# EAGLE design micro_board (EAGLE 7.7.0)
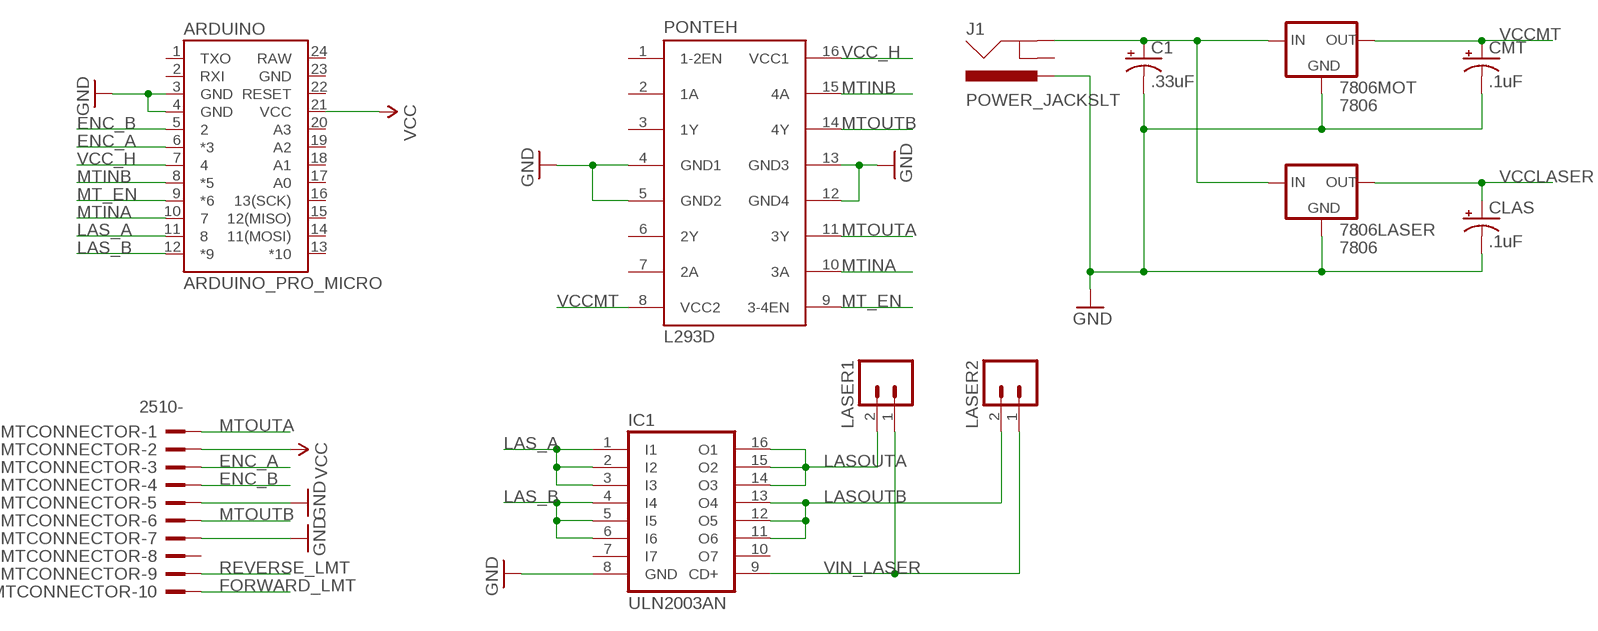
[diagram p0: schematic, sheet 1]

## Parts
7806LASER  7806  V_REG_78XXSINK  [TO220-IGO]
7806MOT  7806  V_REG_78XXSINK  [TO220-IGO]
ARDUINO  ARDUINO_PRO_MICRO  [ARDUINO_PRO_MICRO]
C1  .33uF  CAP_POLPTH1  [CPOL-RADIAL-100UF-25V]
CLAS  .1uF  CAP_POLPTH1  [CPOL-RADIAL-100UF-25V]
CMT  .1uF  CAP_POLPTH1  [CPOL-RADIAL-100UF-25V]
IC1  ULN2003AN  [DIL16]
J1  POWER_JACKSLT  [POWER_JACK_SLOT]
LASER1  M02POLAR  [MOLEX-1X2]
LASER2  M02POLAR  [MOLEX-1X2]
MTCONNECTOR  2510-  [PAK100/2500-10]
PONTEH  L293D  [DIL16]

## Nets
ENC_A: ARDUINO.6(*3) MTCONNECTOR.3
ENC_B: ARDUINO.5 MTCONNECTOR.4
FORWARD_LMT: MTCONNECTOR.10
GND: 7806LASER.GND 7806MOT.GND ARDUINO.3(GND) ARDUINO.4(GND) C1.2(-) CLAS.2(-) CMT.2(-) IC1.8(GND) J1.PWR MTCONNECTOR.5 MTCONNECTOR.7 PONTEH.4(GND1) PONTEH.5(GND2) PONTEH.12(GND4) PONTEH.13(GND3)
LAS_A: ARDUINO.11 IC1.1(I1) IC1.2(I2) IC1.3(I3)
LAS_B: ARDUINO.12(*9) IC1.4(I4) IC1.5(I5) IC1.6(I6)
LASOUTA: IC1.14(O3) IC1.15(O2) IC1.16(O1) LASER1.2
LASOUTB: IC1.11(O6) IC1.12(O5) IC1.13(O4) LASER2.2
MT_EN: ARDUINO.9(*6) PONTEH.9(3-4EN)
MTINA: ARDUINO.10 PONTEH.10(3A)
MTINB: ARDUINO.8(*5) PONTEH.15(4A)
MTOUTA: MTCONNECTOR.1 PONTEH.11(3Y)
MTOUTB: MTCONNECTOR.6 PONTEH.14(4Y)
REVERSE_LMT: MTCONNECTOR.9
SRCIN: 7806LASER.IN 7806MOT.IN C1.1(+) J1.GND@2(GND)
VCC: ARDUINO.21(VCC) MTCONNECTOR.2
VCC_H: ARDUINO.7 PONTEH.16(VCC1)
VCCLASER: 7806LASER.OUT CLAS.1(+)
VCCMT: 7806MOT.OUT CMT.1(+) PONTEH.8(VCC2)
VIN_LASER: IC1.9(CD+) LASER1.1 LASER2.1
Unconnected: ARDUINO.1(TXO) ARDUINO.2(RXI) ARDUINO.13(*10) ARDUINO.14(11(MOSI)) ARDUINO.15(12(MISO)) ARDUINO.16(13(SCK)) ARDUINO.17(A0) ARDUINO.18(A1) ARDUINO.19(A2) ARDUINO.20(A3) ARDUINO.22(RESET) ARDUINO.23(GND) ARDUINO.24(RAW) IC1.7(I7) IC1.10(O7) J1.GND@1(GNDBREAK) MTCONNECTOR.8 PONTEH.1(1-2EN) PONTEH.2(1A) PONTEH.3(1Y) PONTEH.6(2Y) PONTEH.7(2A)

## Library data of the parts
7806LASER 7806MOT = SparkFun-PowerIC:V_REG_78XX: Voltage Regulator Standard 78xx regulator. IGO (Input Ground Output). Spark Fun Electronics SKU : COM-00107
ARDUINO = SparkFun-Boards:ARDUINO_PRO_MICRO
C1 CLAS CMT = SparkFun-Capacitors:CAP_POL: Capacitor Polarized These are standard SMD and PTH capacitors. Normally 10uF, 47uF, and 100uF in electrolytic and tantalum varieties. Always verify the external diameter of the through hole cap, it varies with capacity, voltage, and manufacturer. The EIA devices should be standard.
IC1 = uln-udn:ULN2003A: DRIVER ARRAY
J1 = SparkFun-Connectors:POWER_JACK: Power Jack This is the standard 5.5mm barrel jack for power. The PTH is the most common, proven, reliable, footprint. The Slot footprint only works if the mill layer is transmitted to the PCB fab house so be warned. Mating wall wart : TOL-00298 (and others); PROD_ID: PRT-00119
LASER1 LASER2 = SparkFun-Connectors:M02: Standard 2-pin 0.1" header. Use with - straight break away headers ( PRT-00116) - right angle break away headers (PRT-00553) - swiss pins (PRT-00743) - machine pins (PRT-00117) - female headers (PRT-00115) Molex polarized connector foot print use with: PRT-08233 with associated crimp pins and housings. 2.54_SCREWTERM for use with PRT-10571. 3.5mm Screw Terminal footprints for PRT-08084 5mm Screw Terminal footprints for use with PRT-08432
MTCONNECTOR = con-3m:2510-: 3M (TM) Pak 100 4-Wall Header Source: 3M; MF: 3M; MPN: 2510-6002UB; OC_FARNELL: 9838244; OC_NEWARK: 46F4725
PONTEH = st-microelectronics:L293D: PUSH-PULL 4 CHANNEL DRIVER; MPN: L293D; OC_FARNELL: 9589619; OC_NEWARK: 56P8249

## Board
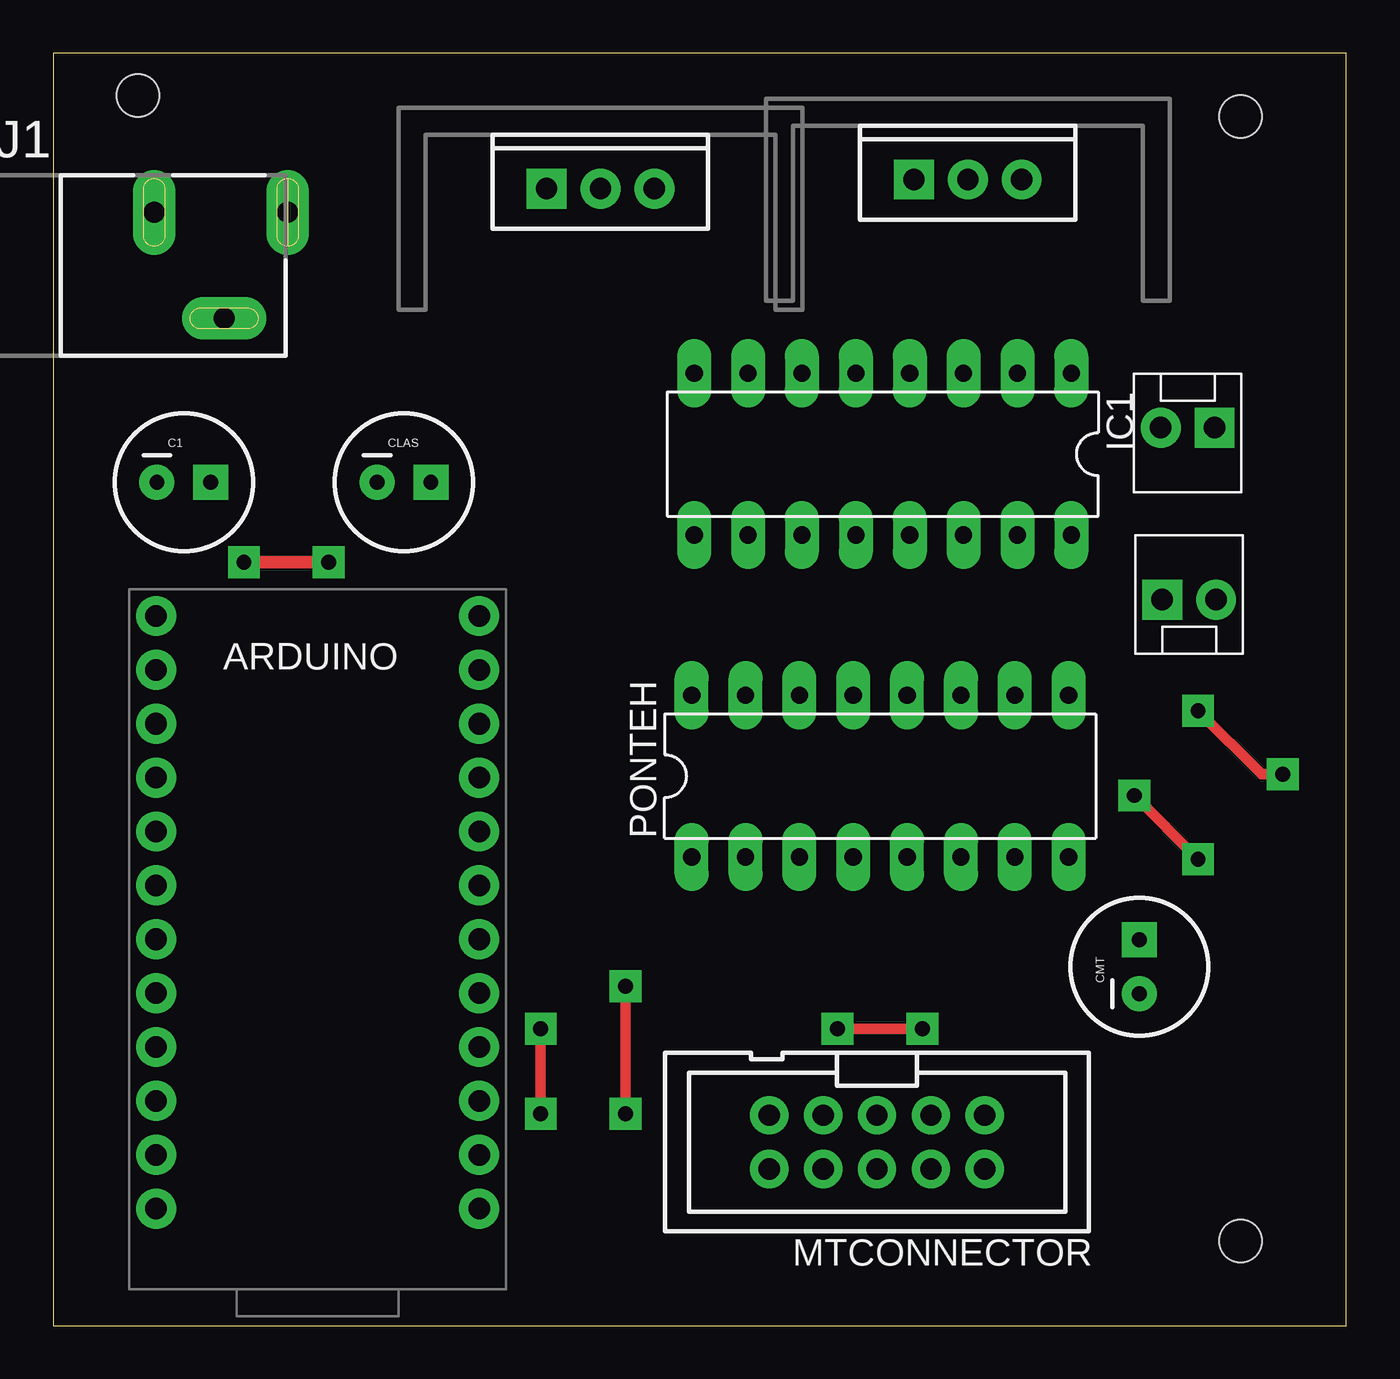
[diagram p1: board, top side]
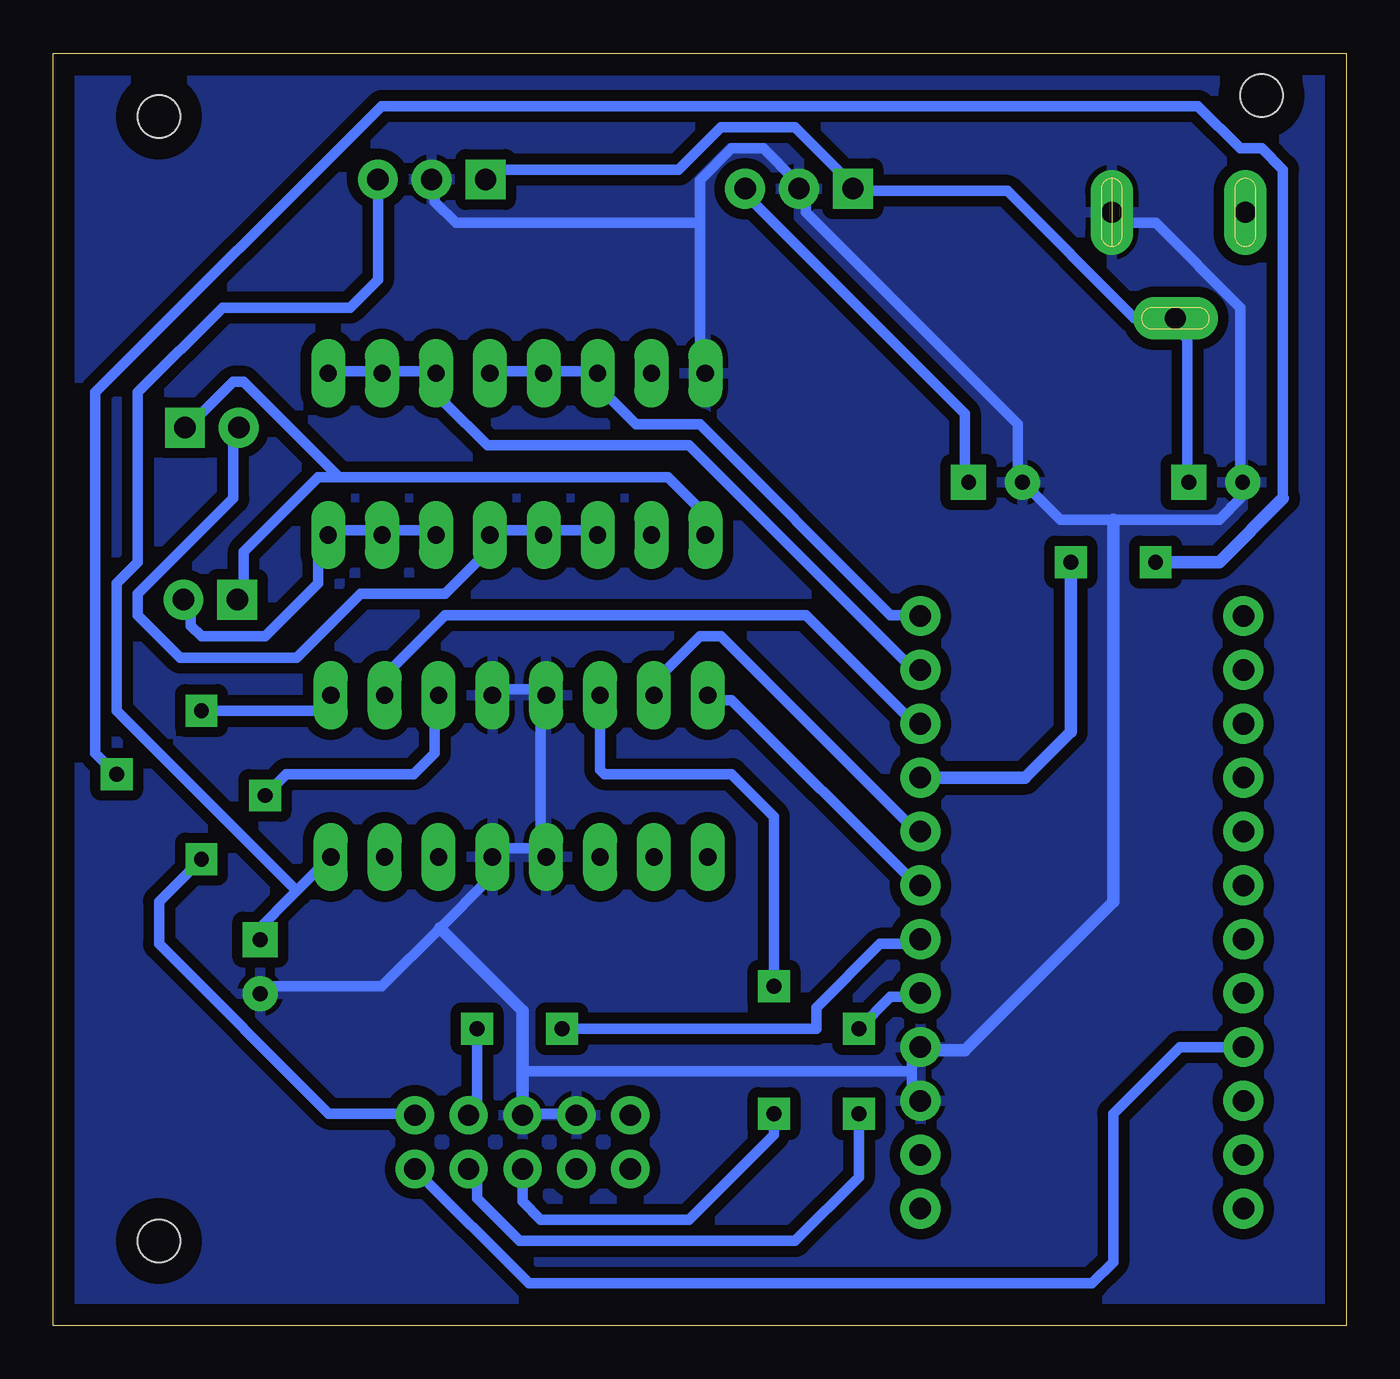
[diagram p2: board, bottom side, seen from below]

Size 61 x 60 mm. Coordinates in mm from the lower left corner, seen from the top.
Outline: 0,0 61,0 61,60 0,60 0,0
Copper layers (1*16): Top 0.035mm / dielectric 1.5mm / Bottom 0.035mm
Design rules "default *": minimum track width 0.5mm, minimum drill 24mil, track to track 0.5mm, track to pad 0.5mm, pad to pad 8mil, via to via 8mil, smd to smd 8mil, copper to edge 40mil, drill to drill 8mil, minimum pad ring 0.4mm, minimum via ring 0.4mm, stop-mask expansion 4mil, vias tented up to drill 0mil, thermal gap 10mil
Holes 2 mm at 4,58 56,4 56,57

### Footprints (pad centres in the part's own frame; a part is rotated, then mirrored left to right if it is on the bottom)
TO220-IGO = drill 1 pad 1.88: GND 0,0; OUT 2.54,0 | drill 1 pad 1.88 square: IN -2.54,0
ARDUINO_PRO_MICRO = drill 1.016 pad 1.88: 1 -7.62,12.7; 2 -7.62,10.16; 3 -7.62,7.62; 4 -7.62,5.08; 5 -7.62,2.54; 6 -7.62,0; 7 -7.62,-2.54; 8 -7.62,-5.08; 9 -7.62,-7.62; 10 -7.62,-10.16; 11 -7.62,-12.7; 12 -7.62,-15.24; 13 7.62,-15.24; 14 7.62,-12.7; 15 7.62,-10.16; 16 7.62,-7.62; 17 7.62,-5.08; 18 7.62,-2.54; 19 7.62,0; 20 7.62,2.54; 21 7.62,5.08; 22 7.62,7.62; 23 7.62,10.16; 24 7.62,12.7
CPOL-RADIAL-100UF-25V = drill 0.7 pad 1.651 square: 1 1.27,0 | drill 0.7 pad 1.651: 2 -1.27,0
DIL16 = drill 0.813 long: 1 -8.89,-3.81; 2 -6.35,-3.81; 3 -3.81,-3.81; 4 -1.27,-3.81; 5 1.27,-3.81; 6 3.81,-3.81; 7 6.35,-3.81; 8 8.89,-3.81; 9 8.89,3.81; 10 6.35,3.81; 11 3.81,3.81; 12 1.27,3.81; 13 -1.27,3.81; 14 -3.81,3.81; 15 -6.35,3.81; 16 -8.89,3.81
POWER_JACK_SLOT = drill 1 pad 2 long: GND@1 2.58,7.5; GND@2 7.58,10.8; PWR 2.58,13.8
MOLEX-1X2 = drill 1.016 pad 1.88 square: 1 0,0 | drill 1.016 pad 1.88: 2 2.54,0
PAK100/2500-10 = drill 1 pad 1.422: 1 -5.08,-1.27; 2 -5.08,1.27; 3 -2.54,-1.27; 4 -2.54,1.27; 5 0,-1.27; 6 0,1.27; 7 2.54,-1.27; 8 2.54,1.27; 9 5.08,-1.27; 10 5.08,1.27

### Placement (x,y rotation side)
7806LASER  25.82,53.61 0 top
7806MOT  43.14,54.04 0 top
ARDUINO  12.48,18.22 180 top
C1  6.17,39.77 0 top
CLAS  16.55,39.77 0 top
CMT  51.23,16.93 90 top
IC1  39.13,41.09 180 top
J1  -2.73,55.07 270 top
LASER1  52.31,34.23 0 top
LASER2  54.78,42.34 180 top
MTCONNECTOR  38.86,8.66 180 top
PONTEH  39.01,25.91 0 top

### Tracks (layer width: path | path; a pad name or v marks a point on that pad's centre or on a via)
ENC_A  (via drill 0.7)
  Top 0.5: v37,14 v41,14
  Bottom 0.5: 41,10.5 41,10 MTCONNECTOR.3 41,10.33 v41,14 | ARDUINO.6 20.5,18 22,18 25,15 25,14 v37,14
ENC_B  (via drill 0.7)
  Top 0.5: v23,14 v23,10
  Bottom 0.5: MTCONNECTOR.4 41,7 41,6 39,4 26,4 23,7 v23,10 | ARDUINO.5 20.5,15.5 21.5,15.5 v23,14
GND
  Bottom 0.5: PONTEH.12 40,30 38,30 PONTEH.13 38,29.5 38,22.5 | 38,22.5 40,22.5 PONTEH.5 40.5,22 40.5,21 42.75,18.75 45.5,16 51,16 CMT.2 | 38,22.5 PONTEH.4 | 20.5,12 20.5,13 ARDUINO.4 | 20.5,12 20.5,11 ARDUINO.3 | MTCONNECTOR.7 36.5,10 38.5,10 MTCONNECTOR.5 | J1.PWR 11,52 9,52 5,48 5,40 C1.2 5,39.5 5,39 6,38 11,38 13.5,38 15,39.5 CLAS.2 15.5,40 15.5,42.5 25.5,52.5 25.5,53.5 7806LASER.GND 26,54 27.5,55.5 29,55.5 30.5,54 30.5,52 | 30.5,52 30.5,45 IC1.8 | 30.5,52 42,52 43,53 43,54 7806MOT.GND | 38.86,12 20.5,12
  Bottom 0.6: 11,38 11,20 18,13 19.96,13 ARDUINO.4 | MTCONNECTOR.5 38.86,12 38.86,14.86 42.75,18.75
  pour Bottom: 0,60 0,0 61,0 61,60
LAS_A
  Bottom 0.5: IC1.1 48,45 45.5,45 IC1.2 45,45 43,45 IC1.3 42.5,44.5 42.5,43.5 40.5,41.5 31,41.5 20.5,31 ARDUINO.11
LAS_B
  Bottom 0.5: IC1.4 40,45 38,45 IC1.5 37.5,45 35.5,45 IC1.6 35.5,44.5 33.5,42.5 30.5,42.5 21.5,33.5 20.5,33.5 ARDUINO.12
LASOUTA
  Bottom 0.5: IC1.14 43,37.5 45,37.5 IC1.15 45.5,37.5 48,37.5 IC1.16 48.5,37 48.5,35 51,32.5 54,32.5 54.5,33 54.5,34 LASER1.2
LASOUTB
  Bottom 0.5: IC1.11 35.5,37.5 37.5,37.5 IC1.12 38,37.5 40,37.5 IC1.13 40,37 42.5,34.5 46.5,34.5 49.5,31.5 55,31.5 57,33.5 57,34.5 52.5,39 52.5,42 LASER2.2
MT_EN  (via drill 0.7)
  Top 0.5: v58,26 57,26 v54,29
  Top 0.6: v13,36 v9,36
  Bottom 0.5: 3,39 3,54.5 4,55.5 5,55.5 7,57.5 45.5,57.5 59,44 59,27 v58,26 | 48,30 PONTEH.9 48.62,29 v54,29
  Bottom 0.6: ARDUINO.9 15.16,25.84 13,28 v13,36 | 3,39 6,36 v9,36
MTINA
  Bottom 0.5: PONTEH.10 45,30 45,31 42.5,33.5 25.5,33.5 20.5,28.5 ARDUINO.10
MTINB
  Bottom 0.5: PONTEH.15 32.5,30 32.5,30.5 30.5,32.5 29.5,32.5 20.5,23.5 ARDUINO.8
MTOUTA  (via drill 0.7)
  Top 0.5: v51,25 v54,22
  Bottom 0.5: PONTEH.11 43,29.5 43,27 44,26 50,26 v51,25 | v54,22 56,20 56,18 48,10 44.01,10 MTCONNECTOR.1
MTOUTB  (via drill 0.7)
  Top 0.5: v27,10 v27,16
  Bottom 0.5: PONTEH.14 35.2,26.2 35,26 29,26 27,24 v27,16 | MTCONNECTOR.6 38.86,5.86 38,5 31,5 27,9 v27,10
N$1
  pour Bottom: 1,59 61,59 61,0 1,0 1,1
SRCIN
  Bottom 0.5: C1.1 7.5,40 7.5,46.5 8,47 J1.GND@2 8.5,47.5 10,47.5 16,53.5 23,53.5 7806LASER.IN 23.5,54 26,56.5 29.5,56.5 31.5,54.5 40.5,54.5 7806MOT.IN
VCC
  Bottom 0.5: 43.5,7 MTCONNECTOR.2 38.55,2 12,2 11,3 11,10 7.86,13.14 ARDUINO.21
VCC_H
  Bottom 0.5: PONTEH.16 30,29.5 29,29.5 20.5,21 ARDUINO.7
VCCLASER
  Bottom 0.5: CLAS.1 18,40 18,43 28.5,53.5 7806LASER.OUT
VCCMT
  Bottom 0.5: 49.5,20.5 51.5,18.5 CMT.1 | 49.5,20.5 PONTEH.8 | 7806MOT.OUT 45.68,49.32 47,48 53,48 57,44 57,36 58,35 58,29 49.5,20.5
VIN_LASER
  Bottom 0.5: 47.5,40 48.5,40 52,36.5 52,34.5 LASER1.1 | 47.5,40 32,40 30.5,38.5 30.5,37.5 IC1.9 | 47.5,40 52,44.5 52.5,44.5 54.5,42.5 LASER2.1